# EAGLE schematic Circuit Diagram (EAGLE 9.6.2)
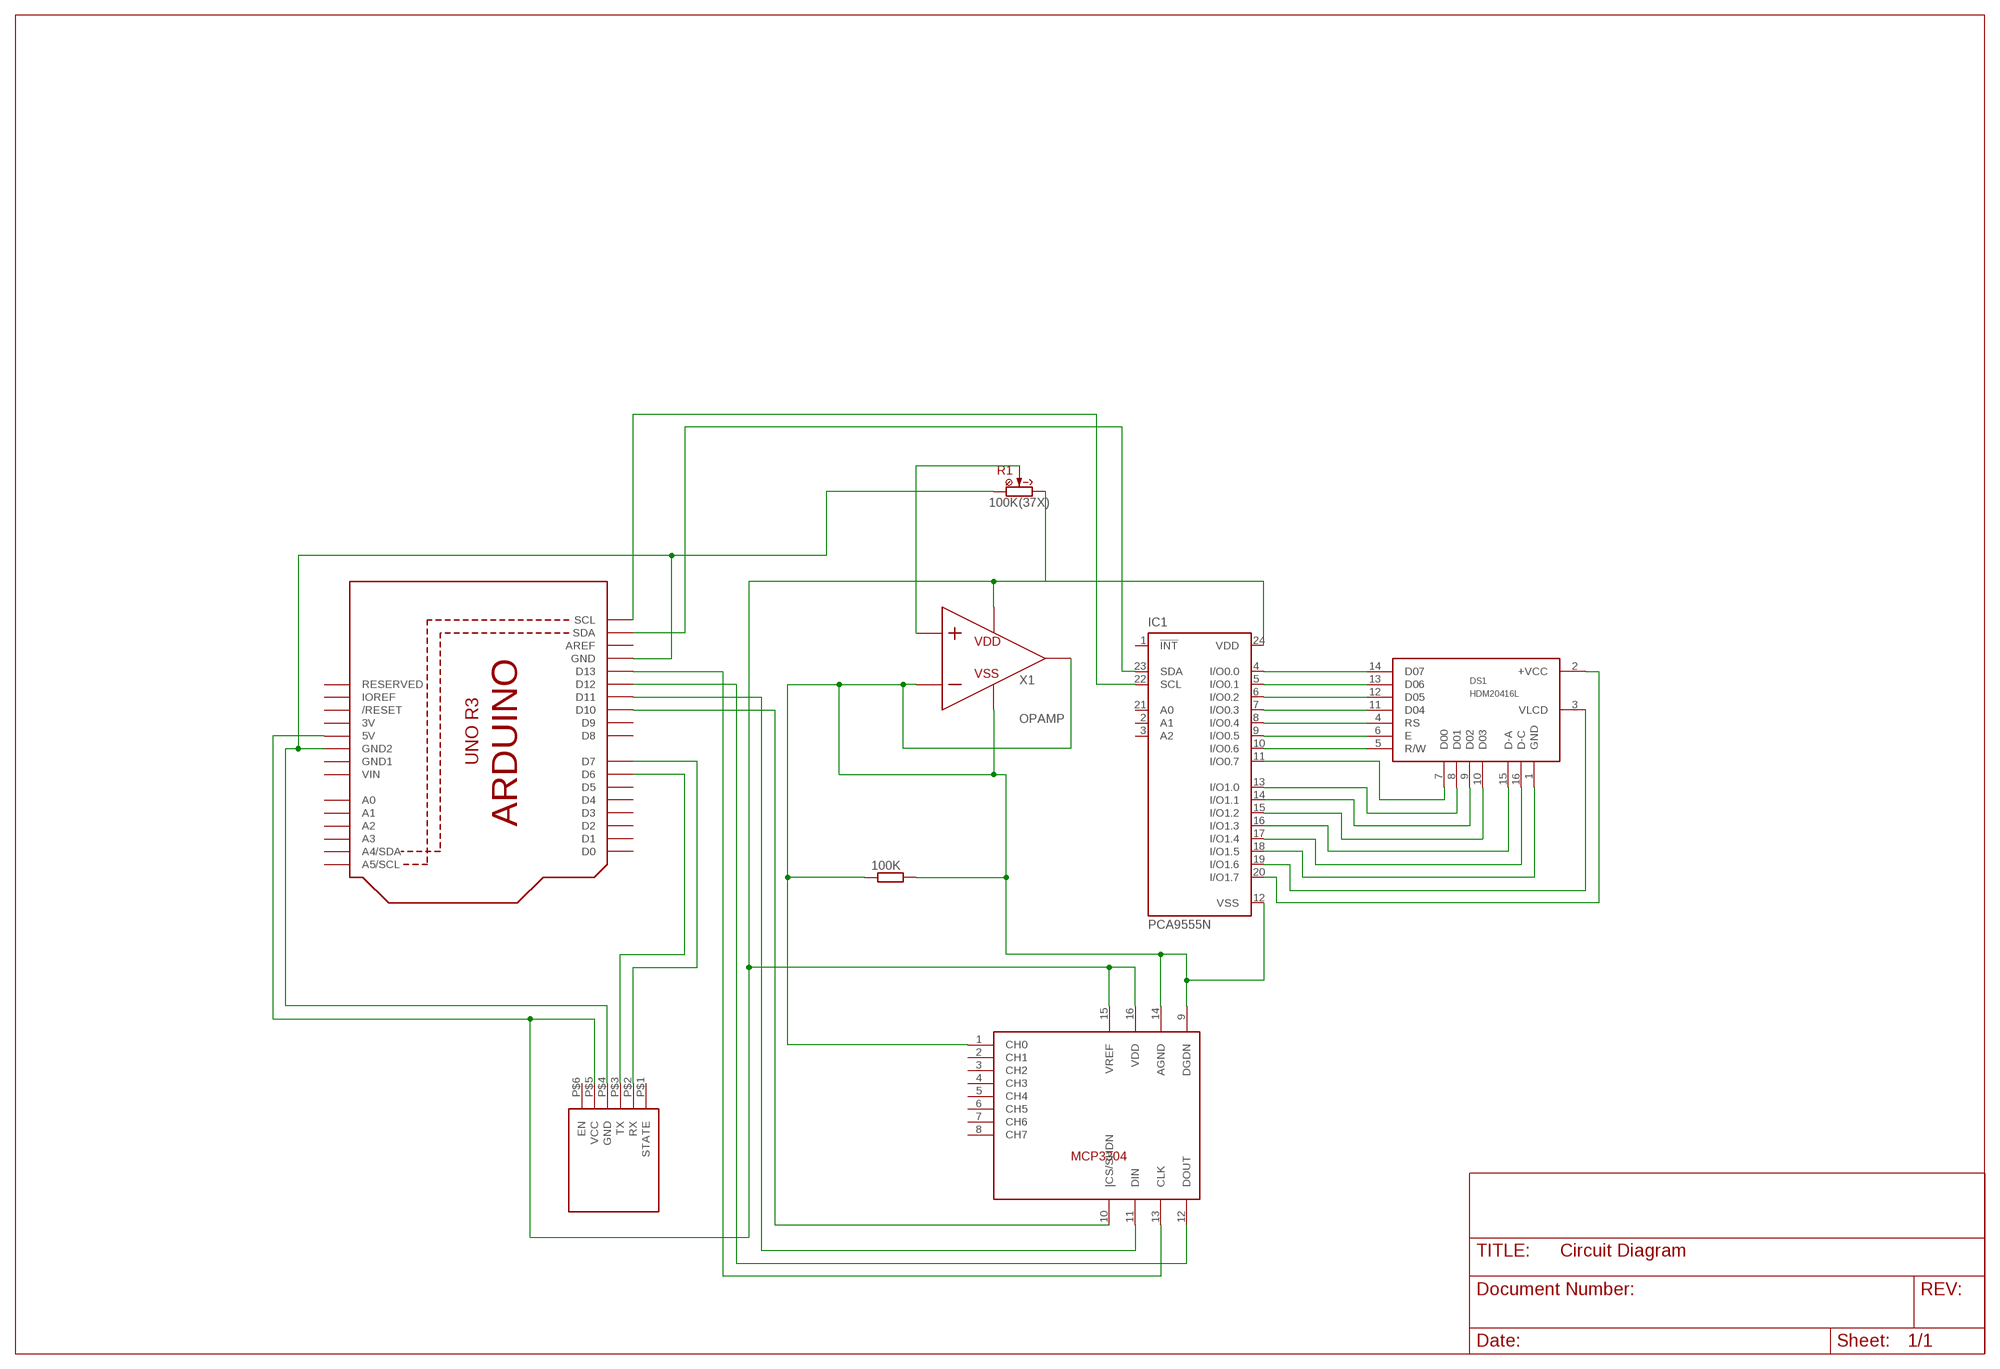
[diagram p0: schematic, sheet 1]

## Parts
100K  R-EU_0207/5V  [0207/5V]
DS1  HDM20416L  [HDM20416L]
IC1  PCA9555N  [DIL24-6]
R1  100K(37X)  [PV37X]
U1  ARDUINOR3-DIMENSION  [ARDUINOR3]
U$1  MCP3304  [DIP16]
U$2  JY-MCU  [JY-MCU]
X1  OPAMP  (no package)

## Nets
N$1: DS1.14(D07) IC1.4(I/O0.0)
N$2: DS1.13(D06) IC1.5(I/O0.1)
N$3: DS1.12(D05) IC1.6(I/O0.2)
N$4: DS1.11(D04) IC1.7(I/O0.3)
N$5: DS1.4(RS) IC1.8(I/O0.4)
N$6: DS1.6(E) IC1.9(I/O0.5)
N$7: DS1.5(R/W) IC1.10(I/O0.6)
N$8: 100K.1 100K.2 IC1.12(VSS) U$1.1(CH0) U$1.9(DGDN) U$1.14(AGND) X1.N X1.VOUT X1.VSS
N$9: DS1.8(D01) IC1.13(I/O1.0)
N$10: DS1.3(VLCD) IC1.19(I/O1.6)
N$11: U1.D6 U$2.P$3(TX)
N$12: U1.D7 U$2.P$2(RX)
N$13: IC1.22(SCL) U1.SCL
N$14: U1.D10 U$1.10(|CS/SHDN)
N$15: R1.S(W) X1.P
N$16: R1.1(CCW) U1.GND U1.GND2 U$2.P$4(GND)
N$17: DS1.7(D00) IC1.11(I/O0.7)
N$18: DS1.2(+VCC) IC1.20(I/O1.7)
N$19: DS1.9(D02) IC1.14(I/O1.1)
N$20: DS1.10(D03) IC1.15(I/O1.2)
N$21: IC1.23(SDA) U1.SDA
N$22: DS1.15(D-A) IC1.16(I/O1.3)
N$23: DS1.16(D-C) IC1.17(I/O1.4)
N$24: DS1.1(GND) IC1.18(I/O1.5)
N$25: IC1.24(VDD) R1.3(CW) U1.5V U$1.15(VREF) U$1.16(VDD) U$2.P$5(VCC) X1.VDD
N$26: U1.D11 U$1.11(DIN)
N$27: U1.D12 U$1.12(DOUT)
N$28: U1.D13 U$1.13(CLK)
Unconnected: IC1.1(!INT) IC1.2(A1) IC1.3(A2) IC1.21(A0) U1.A0 U1.A1 U1.A2 U1.A3 U1.A4(A4/SDA) U1.A5(A5/SCL) U1.AREF U1.D0 U1.D1 U1.D2 U1.D3 U1.D4 U1.D5 U1.D8 U1.D9 U1.IOREF U1.RESERVED U1.RESET(/RESET) U$1.2(CH1) U$1.3(CH2) U$1.4(CH3) U$1.5(CH4) U$1.6(CH5) U$1.7(CH6) U$1.8(CH7) U$2.P$1(STATE) U$2.P$6(EN)

## Power pins joined to a net without a drawn wire
3V: U1.3V
GND1: U1.GND1
VIN: U1.VIN

## Library data of the parts
100K = rcl:R-EU_: RESISTOR, European symbol; SPICEPREFIX: R
DS1 = abi-lcd:HDM20416L
IC1 = micro-philips:PCA9555: 16-bit I2C and SMBus I/O port with interrupt Source: PCA9555_5.pdf
R1 = potentiometers:?(37X); MOUSER: 81-PV37X104C01B00
U1 = adafruit:ARDUINOR3: This is a new object for the new Arduino R3 - with extra pins that you may want to use (such as IOref, and duplicated A4/A5
U$1 = mcp3304:MCP3304: 8 channel ADC converter with SPI interface
U$2 = Bluetooth:JY-MCU
X1 = ngspice-simulation:OPAMP: Operational amplifier with power pins